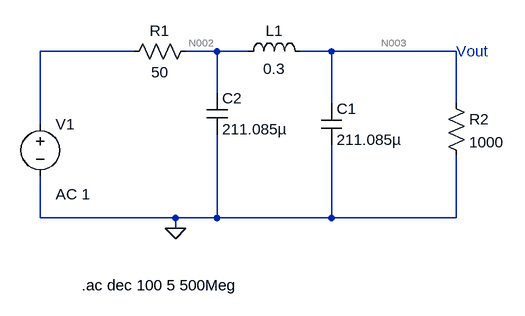
[diagram p0: schematic LI_filter.asc]
LI_filter.asc, the LTspice schematic file:
Version 4
SHEET 1 880 680
WIRE 32 48 -112 48
WIRE 160 48 112 48
WIRE 208 48 160 48
WIRE 336 48 288 48
WIRE 528 48 336 48
WIRE 160 112 160 48
WIRE 336 128 336 48
WIRE 528 128 528 48
WIRE -112 160 -112 48
WIRE -112 304 -112 240
WIRE 96 304 -112 304
WIRE 160 304 160 176
WIRE 160 304 96 304
WIRE 336 304 336 192
WIRE 336 304 160 304
WIRE 528 304 528 208
WIRE 528 304 336 304
WIRE 96 320 96 304
FLAG 96 320 0
SYMBOL res 128 32 R90
WINDOW 0 0 56 VBottom 2
WINDOW 3 32 56 VTop 2
SYMATTR InstName R1
SYMATTR Value 50
SYMBOL res 512 112 R0
SYMATTR InstName R2
SYMATTR Value 1000
SYMBOL voltage -112 144 R0
WINDOW 123 24 124 Left 2
WINDOW 39 0 0 Left 0
SYMATTR InstName V1
SYMATTR Value ""
SYMATTR Value2 AC 1
SYMBOL cap 320 128 R0
SYMATTR InstName C1
SYMATTR Value 211.085µ
SYMBOL ind 192 64 R270
WINDOW 0 32 56 VTop 2
WINDOW 3 5 56 VBottom 2
SYMATTR InstName L1
SYMATTR Value 0.3
SYMBOL cap 144 112 R0
SYMATTR InstName C2
SYMATTR Value 211.085µ
TEXT 528 48 Left 2 ;Vout
TEXT -48 408 Left 2 !.ac dec 100 5 500Meg

The netlist it stands for:
* LI_filter.asc
R1 N002 N001 50
R2 N003 0 1000
V1 N001 0 AC 1
C1 N003 0 211.085µ
L1 N002 N003 0.3
C2 N002 0 211.085µ
* Vout
.ac dec 100 5 500Meg
.backanno
.end

* Results of the author's LTspice run, read from the files saved beside the schematic
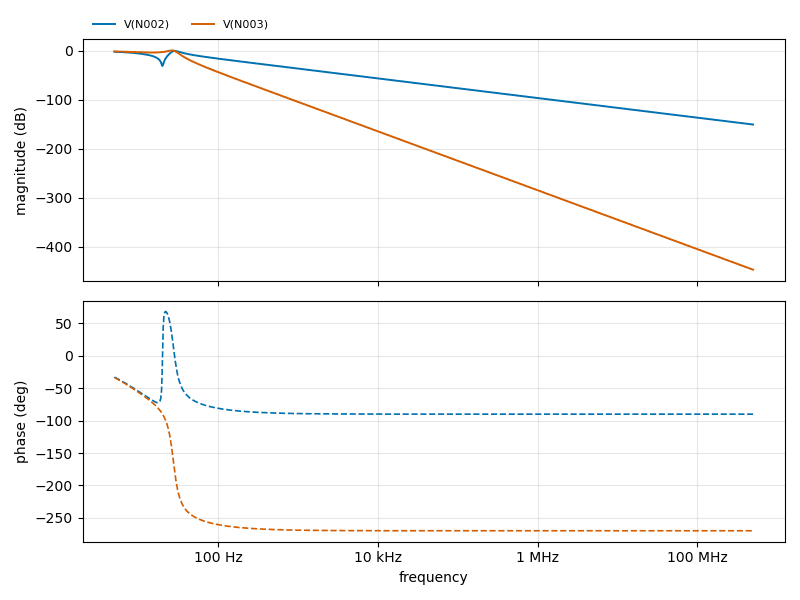
[diagram p1: AC Analysis of LI_filter.asc, plotted from the saved traces]
* AC Analysis, 1 run:
*   V(N002): -2.00 dB at 5 Hz, -150.41 dB at 500 MHz, peak -0.43 dB at 28.77 Hz, 3 dB below the peak at 25.56 Hz and 34.19 Hz
*   V(N003): -1.44 dB at 5 Hz, -446.33 dB at 500 MHz, peak 0.66 dB at 26.24 Hz, 3 dB below the peak at 20.77 Hz and 29.69 Hz